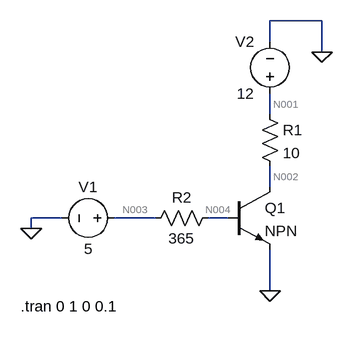
[diagram p0: schematic EJ4.asc]
EJ4.asc, the LTspice schematic file:
Version 4
SHEET 1 880 680
WIRE 464 -208 384 -208
WIRE 384 -176 384 -208
WIRE 464 -160 464 -208
WIRE 384 -64 384 -96
WIRE 384 48 384 16
WIRE 64 96 16 96
WIRE 208 96 144 96
WIRE 320 96 288 96
WIRE 16 112 16 96
WIRE 384 208 384 144
FLAG 384 208 0
FLAG 16 112 0
FLAG 464 -160 0
SYMBOL npn 320 48 R0
SYMATTR InstName Q1
SYMBOL res 368 -80 R0
SYMATTR InstName R1
SYMATTR Value 10
SYMBOL res 192 112 R270
WINDOW 0 32 56 VTop 2
WINDOW 3 0 56 VBottom 2
SYMATTR InstName R2
SYMATTR Value 365
SYMBOL voltage 160 96 R90
WINDOW 0 -32 56 VBottom 2
WINDOW 3 32 56 VTop 2
WINDOW 123 0 0 Left 0
WINDOW 39 0 0 Left 0
SYMATTR InstName V1
SYMATTR Value 5
SYMBOL voltage 384 -80 R180
WINDOW 0 24 96 Left 2
WINDOW 3 24 16 Left 2
WINDOW 123 0 0 Left 0
WINDOW 39 0 0 Left 0
SYMATTR InstName V2
SYMATTR Value 12
TEXT 0 232 Left 2 !.tran 0 1 0 0.1

The netlist it stands for:
* EJ4.asc
Q1 N002 N004 0 0 NPN
R1 N001 N002 10
R2 N003 N004 365
V1 N003 0 5
V2 N001 0 12
.model NPN NPN
.model PNP PNP
.lib standard.bjt
.tran 0 1 0 0.1
.backanno
.end

* Results of the author's LTspice run, read from the files saved beside the schematic
* Operating Point, zero values left out:
*   V(n002) = 919.3 mV
*   V(n004) = 955.6 mV
*   V(n001) = 12 V
*   V(n003) = 5 V
*   Ic(Q1) = 1.108 A
*   Ib(Q1) = 11.08 mA
*   Ie(Q1) = -1.119 A
*   I(R1) = 1.108 A
*   I(R2) = 11.08 mA
*   I(V1) = -11.08 mA
*   I(V2) = -1.108 A
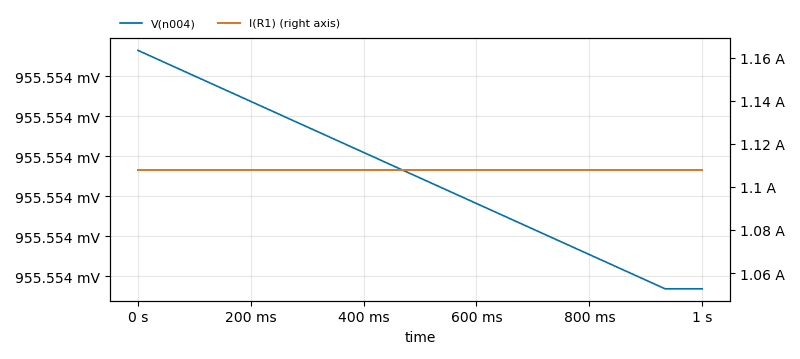
[diagram p1: Transient Analysis of EJ4.asc, plotted from the saved traces]
* Transient Analysis, 1 run:
*   V(n004): min 955.6 mV, max 955.6 mV, average 955.6 mV, rms 955.6 mV, last 955.6 mV
*   I(R1): min 1.108 A, max 1.108 A, average 1.108 A, rms 1.108 A, last 1.108 A